# EAGLE design TINRS - Highly Opinionated (EAGLE 7.7.0)

## Sheet 1 of 6
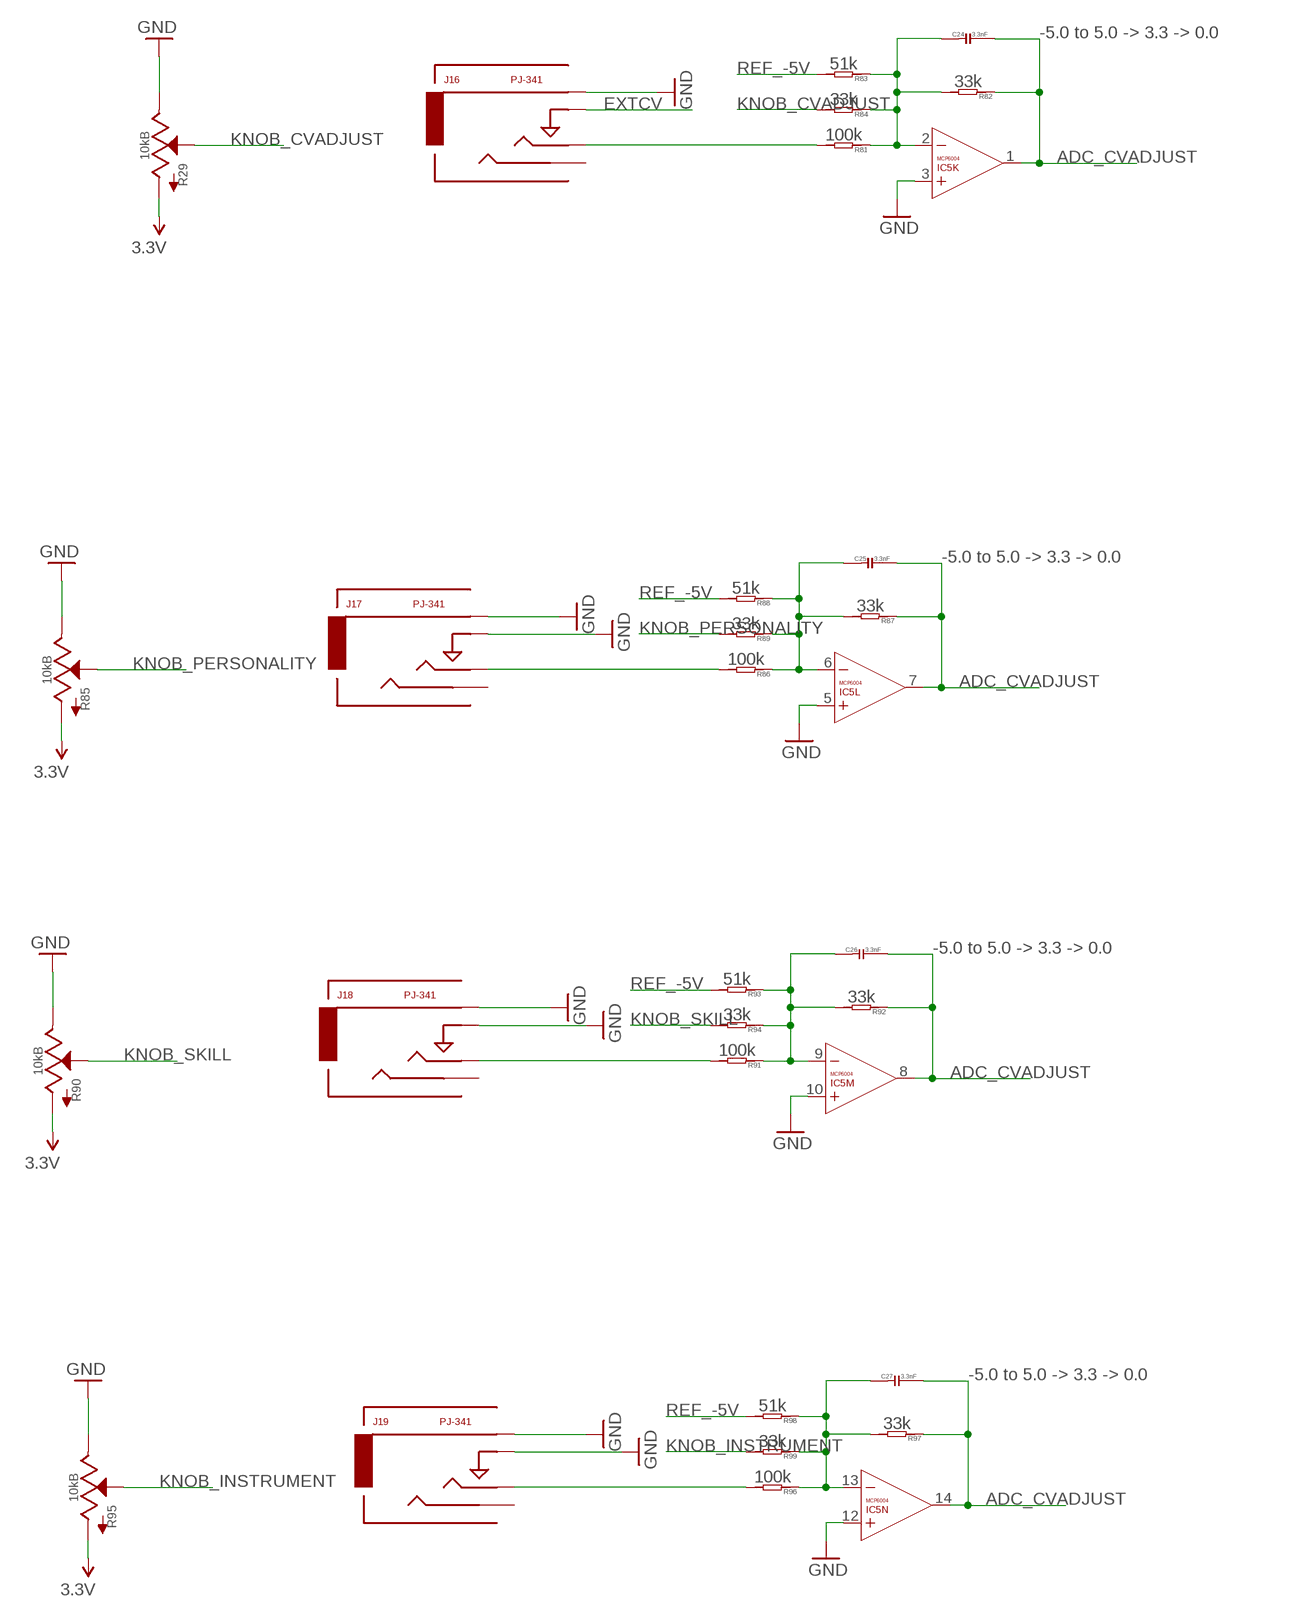
[diagram p0: schematic, sheet 1, part 1 of 2]
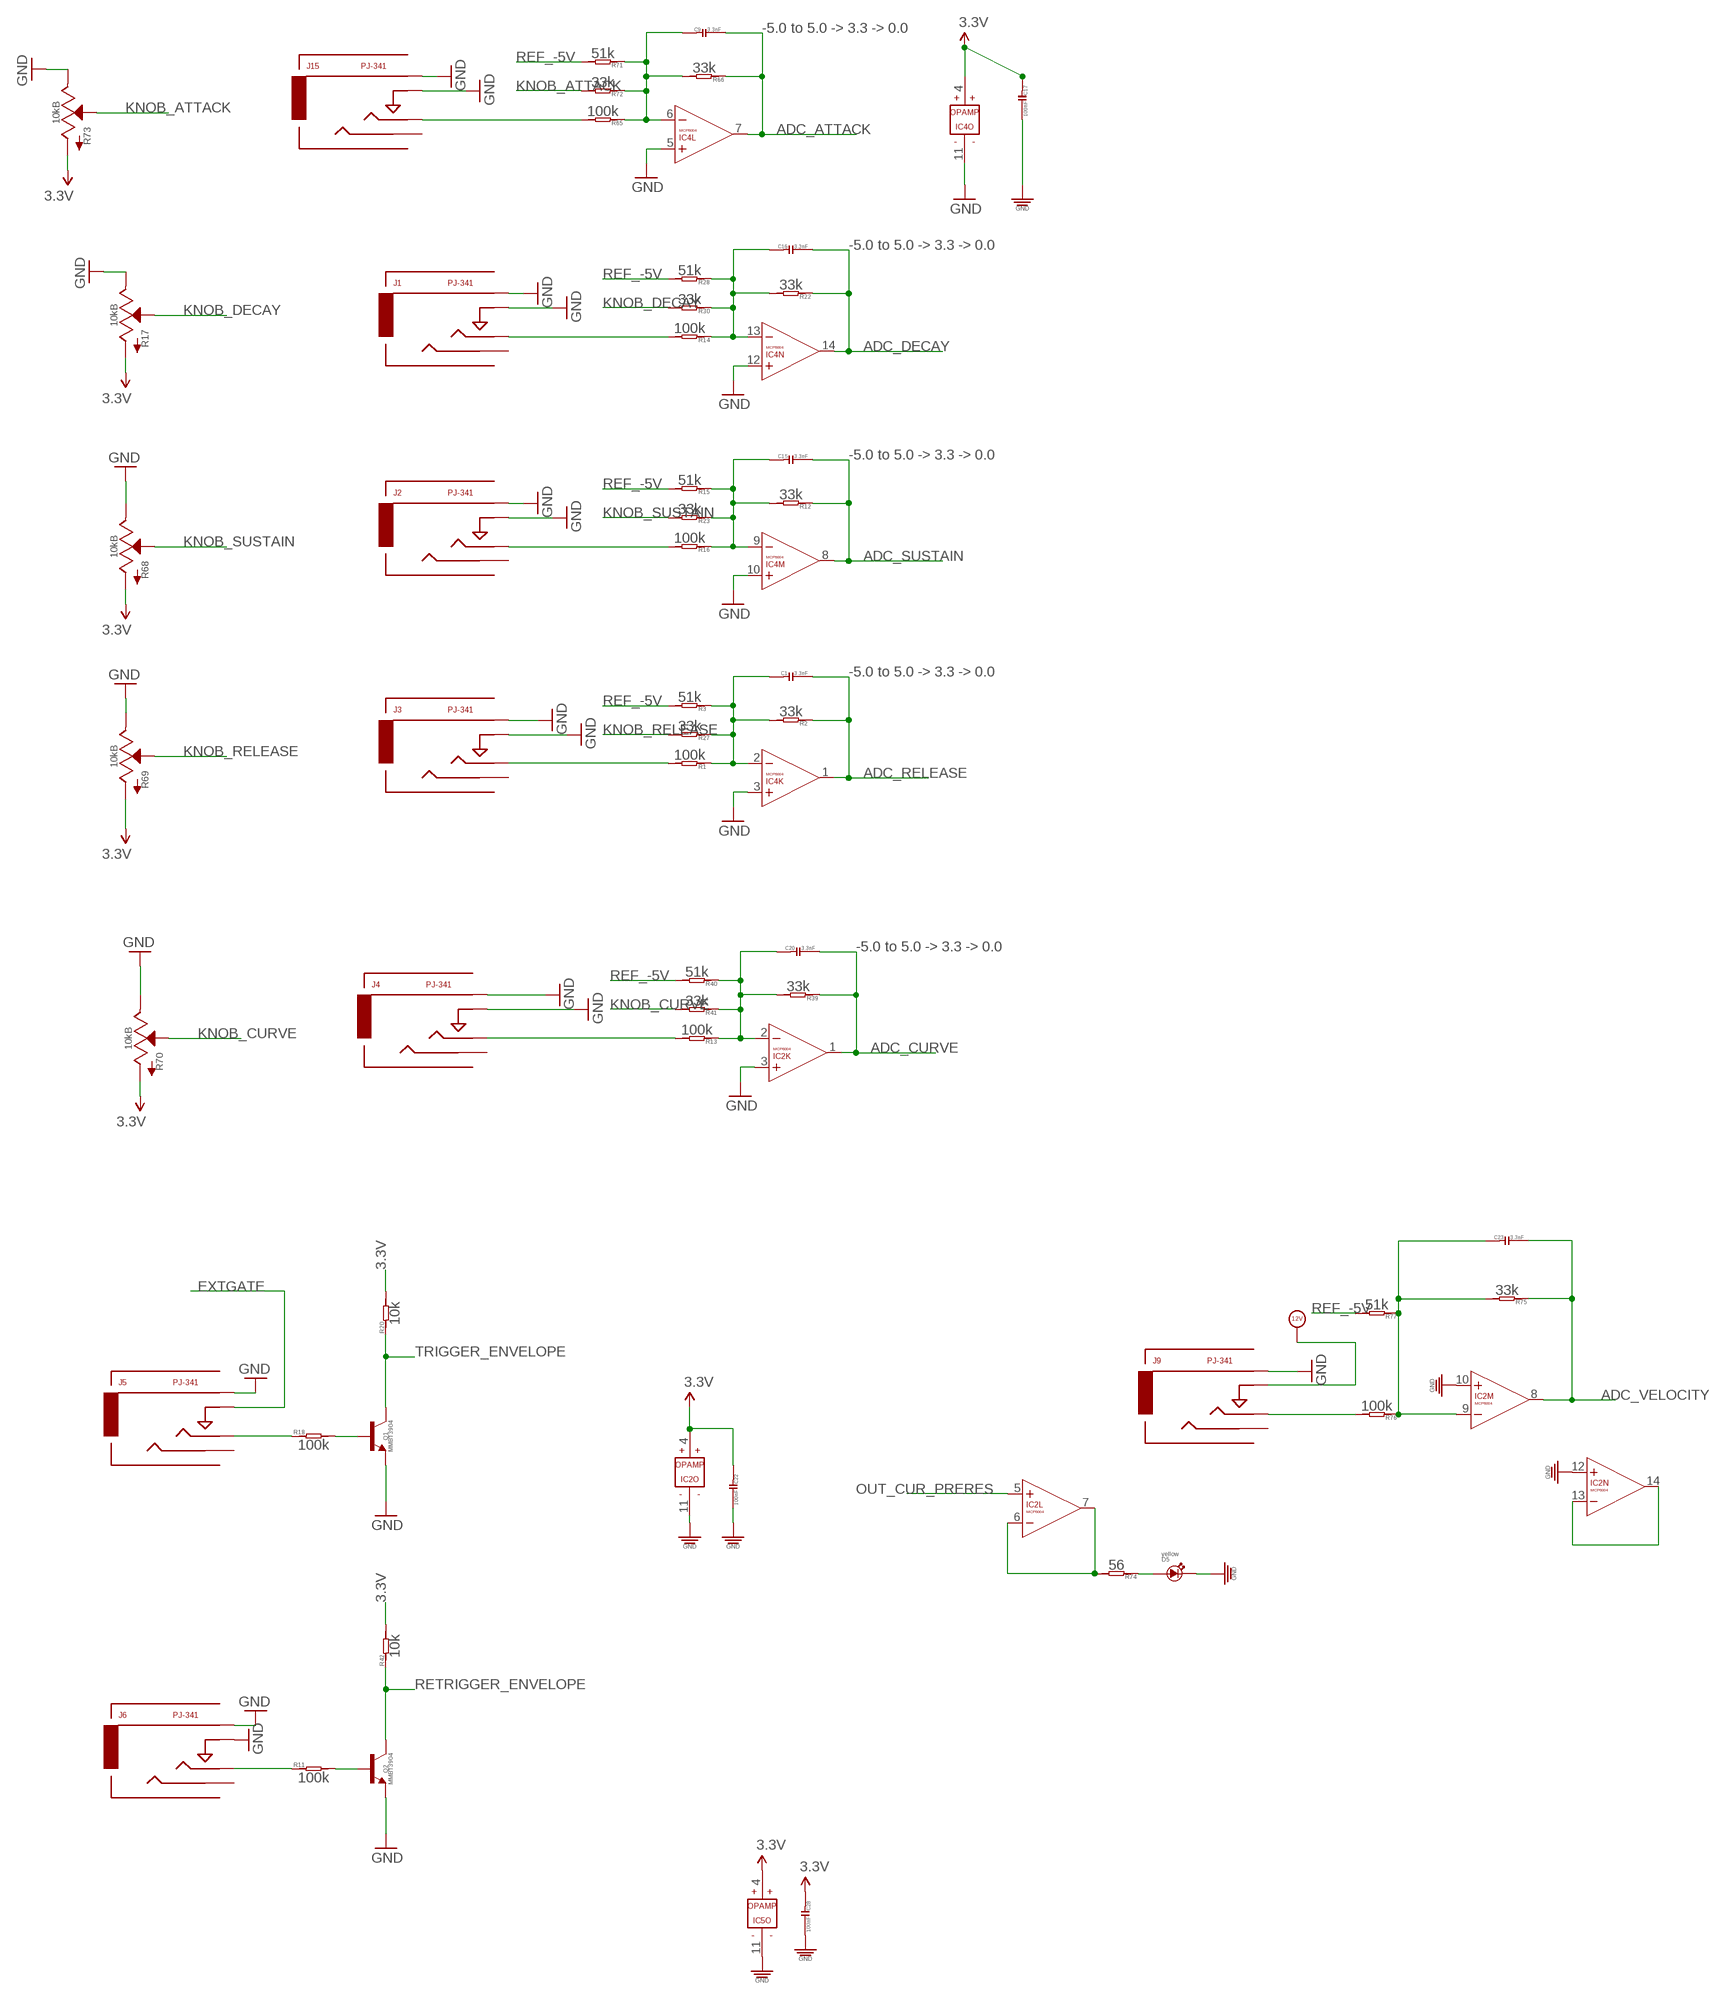
[diagram p1: schematic, sheet 1, part 2 of 2]

### Parts
C1  3.3nF  C-0603  [C0603]
C9  3.3nF  C-0603  [C0603]
C15  3.3nF  C-0603  [C0603]
C16  3.3nF  C-0603  [C0603]
C17  100nF  C-0603  [C0603]
C20  3.3nF  C-0603  [C0603]
C22  100nF  C-0603  [C0603]
C23  3.3nF  C-0603  [C0603]
C24  3.3nF  C-0603  [C0603]
C25  3.3nF  C-0603  [C0603]
C26  3.3nF  C-0603  [C0603]
C27  3.3nF  C-0603  [C0603]
C28  100nF  C-0603  [C0603]
D5  yellow  LED3MM  [3MMLED]
IC2  MCP6004  [SO14]
IC4  MCP6004  [SO14]
IC5  MCP6004  [SO14]
J1  PJ-341  AUDIO-JACKINPUT  [3.5MM-JACK-SWITCH-13MM-INPUT]
J2  PJ-341  AUDIO-JACKINPUT  [3.5MM-JACK-SWITCH-13MM-INPUT]
J3  PJ-341  AUDIO-JACKINPUT  [3.5MM-JACK-SWITCH-13MM-INPUT]
J4  PJ-341  AUDIO-JACKINPUT  [3.5MM-JACK-SWITCH-13MM-INPUT]
J5  PJ-341  AUDIO-JACKINPUT  [3.5MM-JACK-SWITCH-13MM-INPUT]
J6  PJ-341  AUDIO-JACKINPUT  [3.5MM-JACK-SWITCH-13MM-INPUT]
J9  PJ-341  AUDIO-JACKINPUT  [3.5MM-JACK-SWITCH-13MM-INPUT]
J15  PJ-341  AUDIO-JACKINPUT  [3.5MM-JACK-SWITCH-13MM-INPUT]
J16  PJ-341  AUDIO-JACKINPUT  [3.5MM-JACK-SWITCH-13MM-INPUT]
J17  PJ-341  AUDIO-JACKINPUT  [3.5MM-JACK-SWITCH-13MM-INPUT]
J18  PJ-341  AUDIO-JACKINPUT  [3.5MM-JACK-SWITCH-13MM-INPUT]
J19  PJ-341  AUDIO-JACKINPUT  [3.5MM-JACK-SWITCH-13MM-INPUT]
Q1  MMBT3904  MMBT3904LT1-NPN-SOT23-BEC  [SOT23-BEC]
Q2  MMBT3904  MMBT3904LT1-NPN-SOT23-BEC  [SOT23-BEC]
R1  100k  R-0603  [R0603]
R2  33k  R-0603  [R0603]
R3  51k  R-0603  [R0603]
R11  100k  R-0603  [R0603]
R12  33k  R-0603  [R0603]
R13  100k  R-0603  [R0603]
R14  100k  R-0603  [R0603]
R15  51k  R-0603  [R0603]
R16  100k  R-0603  [R0603]
R17  10kB  POTSQUAREHOLE_SMALLKNOB  [ALPS_POT_SQUAREHOLES]
R18  100k  R-0603  [R0603]
R20  10k  R-0603  [R0603]
R22  33k  R-0603  [R0603]
R23  33k  R-0603  [R0603]
R27  33k  R-0603  [R0603]
R28  51k  R-0603  [R0603]
R29  10kB  POTSQUAREHOLE_SMALLKNOB  [ALPS_POT_SQUAREHOLES]
R30  33k  R-0603  [R0603]
R39  33k  R-0603  [R0603]
R40  51k  R-0603  [R0603]
R41  33k  R-0603  [R0603]
R42  10k  R-0603  [R0603]
R65  100k  R-0603  [R0603]
R66  33k  R-0603  [R0603]
R68  10kB  POTSQUAREHOLE_SMALLKNOB  [ALPS_POT_SQUAREHOLES]
R69  10kB  POTSQUAREHOLE_SMALLKNOB  [ALPS_POT_SQUAREHOLES]
R70  10kB  POTSQUAREHOLE_SMALLKNOB  [ALPS_POT_SQUAREHOLES]
R71  51k  R-0603  [R0603]
R72  33k  R-0603  [R0603]
R73  10kB  POTSQUAREHOLE_SMALLKNOB  [ALPS_POT_SQUAREHOLES]
R74  56  R-0603  [R0603]
R75  33k  R-0603  [R0603]
R76  100k  R-0603  [R0603]
R77  51k  R-0603  [R0603]
R81  100k  R-0603  [R0603]
R82  33k  R-0603  [R0603]
R83  51k  R-0603  [R0603]
R84  33k  R-0603  [R0603]
R85  10kB  POTSQUAREHOLE_SMALLKNOB  [ALPS_POT_SQUAREHOLES]
R86  100k  R-0603  [R0603]
R87  33k  R-0603  [R0603]
R88  51k  R-0603  [R0603]
R89  33k  R-0603  [R0603]
R90  10kB  POTSQUAREHOLE_SMALLKNOB  [ALPS_POT_SQUAREHOLES]
R91  100k  R-0603  [R0603]
R92  33k  R-0603  [R0603]
R93  51k  R-0603  [R0603]
R94  33k  R-0603  [R0603]
R95  10kB  POTSQUAREHOLE_SMALLKNOB  [ALPS_POT_SQUAREHOLES]
R96  100k  R-0603  [R0603]
R97  33k  R-0603  [R0603]
R98  51k  R-0603  [R0603]
R99  33k  R-0603  [R0603]

### Nets
3.3V [mediumpower]: C17.1 C22.1 C28.1 IC2.4(O:V+) IC4.4(O:V+) IC5.4(O:V+) R17.P$3(A) R20.2 R29.P$3(A) R42.2 R68.P$3(A) R69.P$3(A) R70.P$3(A) R73.P$3(A) R85.P$3(A) R90.P$3(A) R95.P$3(A) ; also sheet 2,3,4,5,6
12V [heavypower]: J9.SWITCH@3(SWITCH) ; also sheet 3,4,5
ADC_ATTACK: C9.2 IC4.7(L:OUT) R66.1 ; also sheet 6
ADC_CURVE: C20.2 IC2.1(K:OUT) R39.1 ; also sheet 6
ADC_CVADJUST: C24.2 C25.2 C26.2 C27.2 IC5.1(K:OUT) IC5.7(L:OUT) IC5.8(M:OUT) IC5.14(N:OUT) R82.1 R87.1 R92.1 R97.1
ADC_DECAY: C16.2 IC4.14(N:OUT) R22.1 ; also sheet 6
ADC_RELEASE: C1.2 IC4.1(K:OUT) R2.1 ; also sheet 6
ADC_SUSTAIN: C15.2 IC4.8(M:OUT) R12.1 ; also sheet 6
ADC_VELOCITY: C23.2 IC2.8(M:OUT) R75.1 ; also sheet 6
EXTCV: J16.SWITCH@3(SWITCH) ; also sheet 3
EXTGATE: J5.SWITCH@3(SWITCH) ; also sheet 3
GND [groundplane]: C17.2 C22.2 C28.2 D5.- IC2.3(K:+IN) IC2.10(M:+IN) IC2.11(O:V-) IC2.12(N:+IN) IC4.3(K:+IN) IC4.5(L:+IN) IC4.10(M:+IN) IC4.11(O:V-) IC4.12(N:+IN) IC5.3(K:+IN) IC5.5(L:+IN) IC5.10(M:+IN) IC5.11(O:V-) IC5.12(N:+IN) J1.RING@3(RING) J1.SWITCH@3(SWITCH) J2.RING@3(RING) J2.SWITCH@3(SWITCH) J3.RING@3(RING) J3.SWITCH@3(SWITCH) J4.RING@3(RING) J4.SWITCH@3(SWITCH) J5.RING@3(RING) J6.RING@3(RING) J6.SWITCH@3(SWITCH) J9.RING@3(RING) J15.RING@3(RING) J15.SWITCH@3(SWITCH) J16.RING@3(RING) J17.RING@3(RING) J17.SWITCH@3(SWITCH) J18.RING@3(RING) J18.SWITCH@3(SWITCH) J19.RING@3(RING) J19.SWITCH@3(SWITCH) Q1.E Q2.E R17.P$1(E) R29.P$1(E) R68.P$1(E) R69.P$1(E) R70.P$1(E) R73.P$1(E) R85.P$1(E) R90.P$1(E) R95.P$1(E) ; also sheet 2,3,4,5,6
KNOB_ATTACK: R72.2 R73.P$2(S)
KNOB_CURVE: R41.2 R70.P$2(S)
KNOB_CVADJUST: R29.P$2(S) R84.2
KNOB_DECAY: R17.P$2(S) R30.2
KNOB_INSTRUMENT: R95.P$2(S) R99.2
KNOB_PERSONALITY: R85.P$2(S) R89.2
KNOB_RELEASE: R27.2 R69.P$2(S)
KNOB_SKILL: R90.P$2(S) R94.2
KNOB_SUSTAIN: R23.2 R68.P$2(S)
N$3: J2.TIP@3(TIP) R16.2
N$4: C15.1 IC4.9(M:-IN) R12.2 R15.1 R16.1 R23.1
N$6: J3.TIP@3(TIP) R1.2
N$8: C1.1 IC4.2(K:-IN) R1.1 R2.2 R3.1 R27.1
N$9: J16.TIP@3(TIP) R81.2
N$10: C24.1 IC5.2(K:-IN) R81.1 R82.2 R83.1 R84.1
N$11: J15.TIP@3(TIP) R65.2
N$12: J4.TIP@3(TIP) R13.2
N$15: Q1.B R18.2
N$16: J5.TIP@3(TIP) R18.1
N$19 [groundplane]: IC2.6(L:-IN) IC2.7(L:OUT) R74.2
N$22: C9.1 IC4.6(L:-IN) R65.1 R66.2 R71.1 R72.1
N$26 [groundplane]: IC2.13(N:-IN) IC2.14(N:OUT)
N$33: J1.TIP@3(TIP) R14.2
N$34: C16.1 IC4.13(N:-IN) R14.1 R22.2 R28.1 R30.1
N$43: Q2.B R11.2
N$46: C20.1 IC2.2(K:-IN) R13.1 R39.2 R40.1 R41.1
N$47: J6.TIP@3(TIP) R11.1
N$56: C23.1 IC2.9(M:-IN) R75.2 R76.1 R77.1
N$59: D5.+ R74.1
N$60: J17.TIP@3(TIP) R86.2
N$61: J9.TIP@3(TIP) R76.2
N$62: C25.1 IC5.6(L:-IN) R86.1 R87.2 R88.1 R89.1
N$63: J18.TIP@3(TIP) R91.2
N$65: C26.1 IC5.9(M:-IN) R91.1 R92.2 R93.1 R94.1
N$66: J19.TIP@3(TIP) R96.2
N$67: C27.1 IC5.13(N:-IN) R96.1 R97.2 R98.1 R99.1
OUT_CUR_PRERES: IC2.5(L:+IN) ; also sheet 4
REF_-5V: R3.2 R15.2 R28.2 R40.2 R71.2 R77.2 R83.2 R88.2 R93.2 R98.2 ; also sheet 3,4
RETRIGGER_ENVELOPE: Q2.C R42.1 ; also sheet 6
TRIGGER_ENVELOPE: Q1.C R20.1 ; also sheet 6
Unconnected: J1.SECOND@3(SECOND) J2.SECOND@3(SECOND) J3.SECOND@3(SECOND) J4.SECOND@3(SECOND) J5.SECOND@3(SECOND) J6.SECOND@3(SECOND) J9.SECOND@3(SECOND) J15.SECOND@3(SECOND) J16.SECOND@3(SECOND) J17.SECOND@3(SECOND) J18.SECOND@3(SECOND) J19.SECOND@3(SECOND)

### Notes on the sheet
- -5.0 to 5.0 -> 3.3 -> 0.0
- -5.0 to 5.0 -> 3.3 -> 0.0
- -5.0 to 5.0 -> 3.3 -> 0.0
- -5.0 to 5.0 -> 3.3 -> 0.0
- -5.0 to 5.0 -> 3.3 -> 0.0
- -5.0 to 5.0 -> 3.3 -> 0.0
- -5.0 to 5.0 -> 3.3 -> 0.0
- -5.0 to 5.0 -> 3.3 -> 0.0
- -5.0 to 5.0 -> 3.3 -> 0.0

## Sheet 2 of 6: LEDS and Buttons
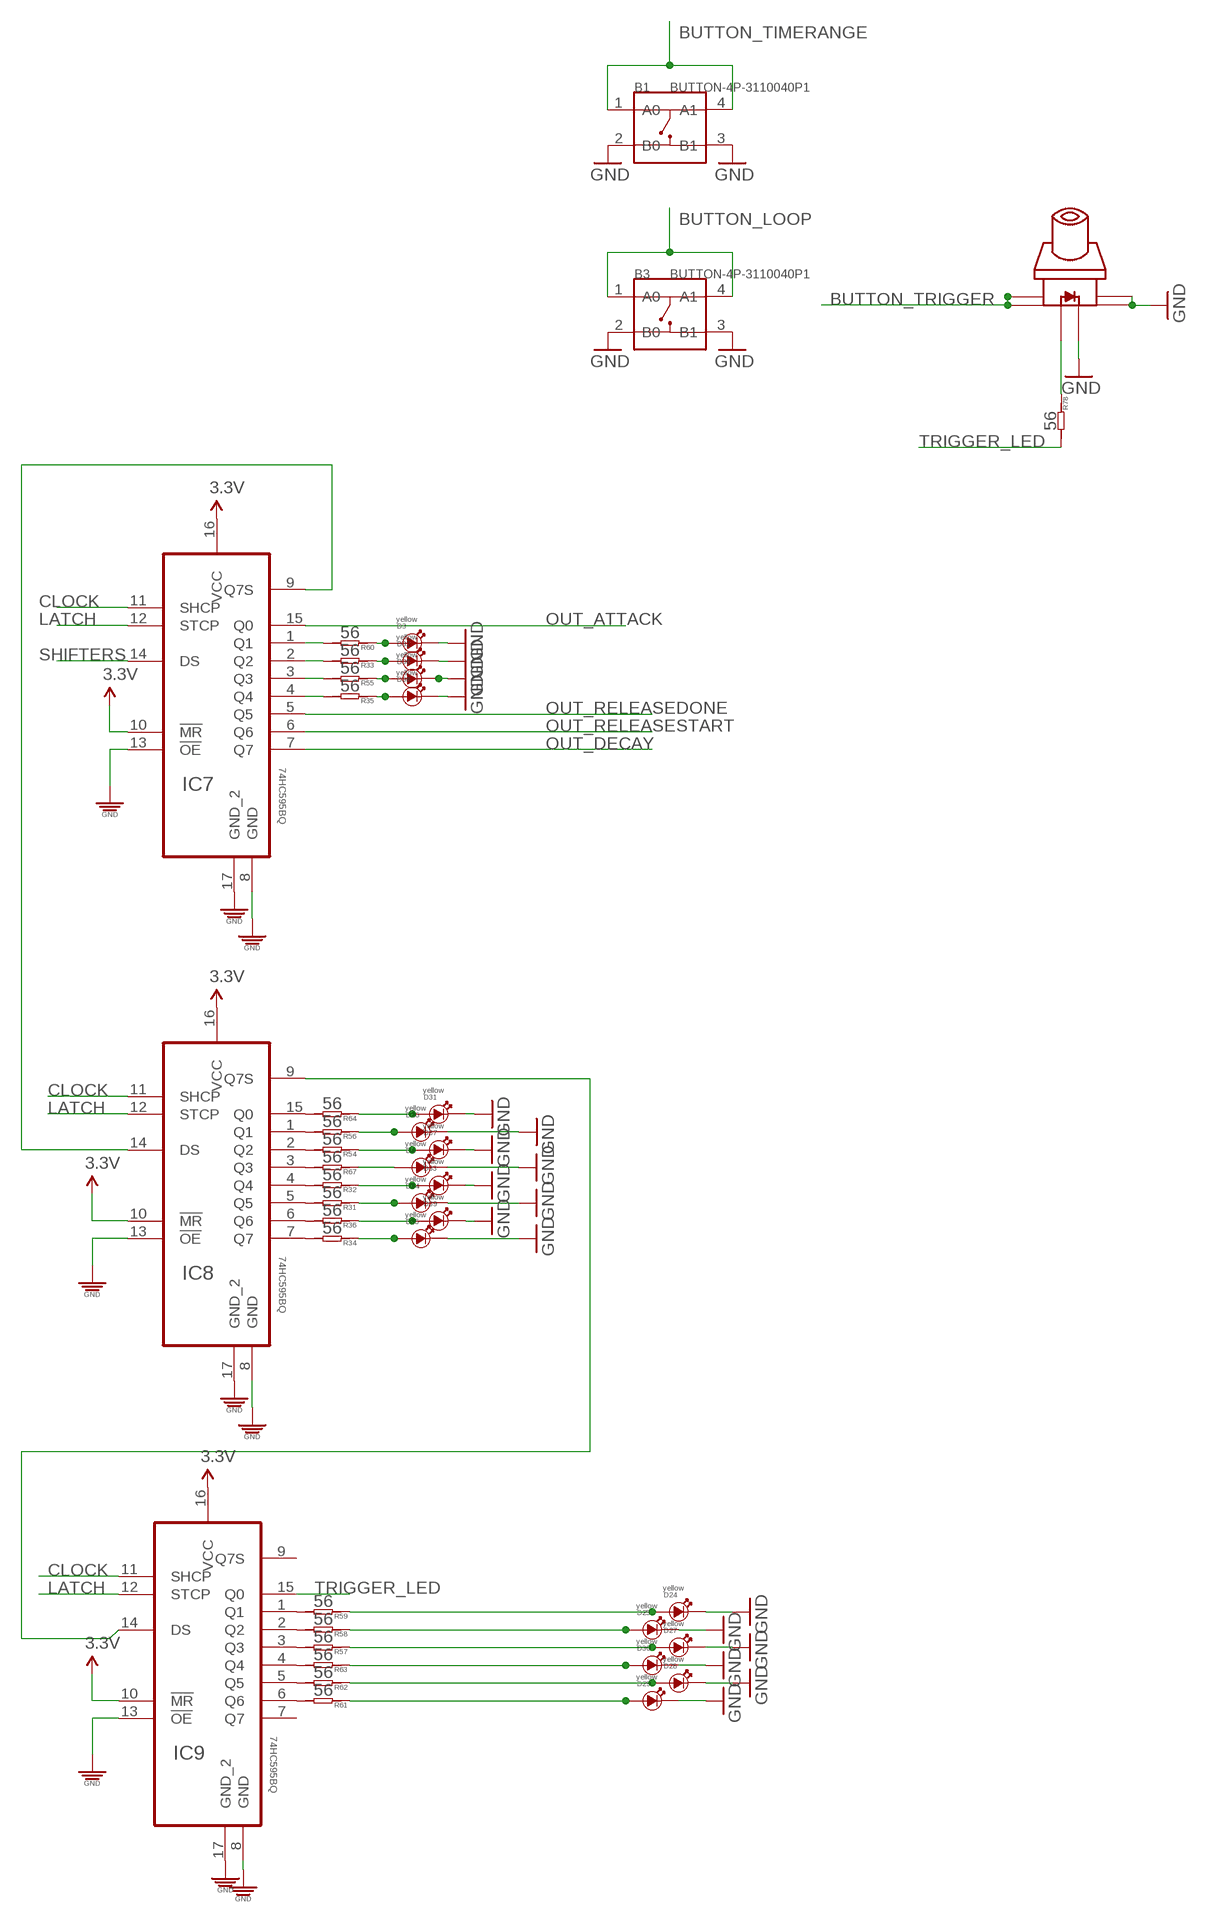
[diagram p2: schematic, sheet 2]

### Parts
B1  BUTTON-4P-3110040P1  [4P-6.0X6.0X5.0H]
B3  BUTTON-4P-3110040P1  [4P-6.0X6.0X5.0H]
D3  yellow  LED3MM  [3MMLED]
D4  yellow  LED3MM  [3MMLED]
D24  yellow  LED3MM  [3MMLED]
D25  yellow  LED3MM  [3MMLED]
D26  yellow  LED3MM  [3MMLED]
D27  yellow  LED3MM  [3MMLED]
D28  yellow  LED3MM  [3MMLED]
D29  yellow  LED3MM  [3MMLED]
D30  yellow  LED3MM  [3MMLED]
D31  yellow  LED3MM  [3MMLED]
D32  yellow  LED3MM  [3MMLED]
D33  yellow  LED3MM  [3MMLED]
D34  yellow  LED3MM  [3MMLED]
D35  yellow  LED3MM  [3MMLED]
D36  yellow  LED3MM  [3MMLED]
D37  yellow  LED3MM  [3MMLED]
D38  yellow  LED3MM  [3MMLED]
D39  yellow  LED3MM  [3MMLED]
IC7  74HC595BQ  [QFN50P250X350X100-17N]
IC8  74HC595BQ  [QFN50P250X350X100-17N]
IC9  74HC595BQ  [QFN50P250X350X100-17N]
R31  56  R-0603  [R0603]
R32  56  R-0603  [R0603]
R33  56  R-0603  [R0603]
R34  56  R-0603  [R0603]
R35  56  R-0603  [R0603]
R36  56  R-0603  [R0603]
R54  56  R-0603  [R0603]
R55  56  R-0603  [R0603]
R56  56  R-0603  [R0603]
R57  56  R-0603  [R0603]
R58  56  R-0603  [R0603]
R59  56  R-0603  [R0603]
R60  56  R-0603  [R0603]
R61  56  R-0603  [R0603]
R62  56  R-0603  [R0603]
R63  56  R-0603  [R0603]
R64  56  R-0603  [R0603]
R67  56  R-0603  [R0603]
R78  56  R-0603  [R0603]
U$2  SWITCH_W_LED_PB6149L-X-102YELLOW  [PB6149L]

### Nets
3.3V [mediumpower]: IC7.10(!MR) IC7.16(VCC) IC8.10(!MR) IC8.16(VCC) IC9.10(!MR) IC9.16(VCC) ; also sheet 1,3,4,5,6
BUTTON_LOOP: B3.1(A0) B3.4(A1) ; also sheet 6
BUTTON_TIMERANGE: B1.1(A0) B1.4(A1) ; also sheet 6
BUTTON_TRIGGER: U$2.1 U$2.2 ; also sheet 6
CLOCK: IC7.11(SHCP) IC8.11(SHCP) IC9.11(SHCP) ; also sheet 6
GND [groundplane]: B1.2(B0) B1.3(B1) B3.2(B0) B3.3(B1) D3.- D4.- D24.- D25.- D26.- D27.- D28.- D29.- D30.- D31.- D32.- D33.- D34.- D35.- D36.- D37.- D38.- D39.- IC7.8(GND) IC7.13(!OE) IC7.17(GND_2) IC8.8(GND) IC8.13(!OE) IC8.17(GND_2) IC9.8(GND) IC9.13(!OE) IC9.17(GND_2) U$2.3 U$2.4 U$2.LEDNEG(NEG) ; also sheet 1,3,4,5,6
LATCH: IC7.12(STCP) IC8.12(STCP) IC9.12(STCP) ; also sheet 6
N$1: R78.1 U$2.LEDPOS(POS)
N$14: IC8.7(Q7) R34.2
N$27: IC8.15(Q0) R64.2
N$28: D28.+ R62.1
N$30: D4.+ R67.1
N$31: IC7.1(Q1) R60.2
N$32: D29.+ R61.1
N$35: IC7.2(Q2) R33.2
N$36: IC7.3(Q3) R55.2
N$37: IC7.4(Q4) R35.2
N$38: IC8.1(Q1) R56.2
N$39: IC8.2(Q2) R54.2
N$40: IC8.3(Q3) R67.2
N$41: IC8.4(Q4) R32.2
N$42: IC8.5(Q5) R31.2
N$48: IC8.6(Q6) R36.2
N$49: IC9.1(Q1) R59.2
N$50: IC9.2(Q2) R58.2
N$51: D3.+ R60.1
N$52: IC9.3(Q3) R57.2
N$53: IC9.4(Q4) R63.2
N$54: IC9.5(Q5) R62.2
N$55: IC9.6(Q6) R61.2
N$73: D27.+ R57.1
N$74: D26.+ R56.1
N$75: D25.+ R58.1
N$76: D24.+ R59.1
N$77: D30.+ R63.1
N$78: D31.+ R64.1
N$79: D32.+ R33.1
N$80: D33.+ R32.1
N$81: D34.+ R31.1
N$82: D35.+ R34.1
N$83: D36.+ R55.1
N$84: D37.+ R54.1
N$85: D38.+ R35.1
N$86: D39.+ R36.1
OUT_ATTACK: IC7.15(Q0) ; also sheet 5
OUT_DECAY: IC7.7(Q7) ; also sheet 5
OUT_RELEASEDONE: IC7.5(Q5) ; also sheet 5
OUT_RELEASESTART: IC7.6(Q6) ; also sheet 5
SHIFTER1TO2: IC7.9(Q7S) IC8.14(DS)
SHIFTER2TO3: IC8.9(Q7S) IC9.14(DS)
SHIFTERS: IC7.14(DS) ; also sheet 6
TRIGGER_LED: IC9.15(Q0) R78.2
Unconnected: IC9.7(Q7) IC9.9(Q7S)

## Sheet 3 of 6: Power
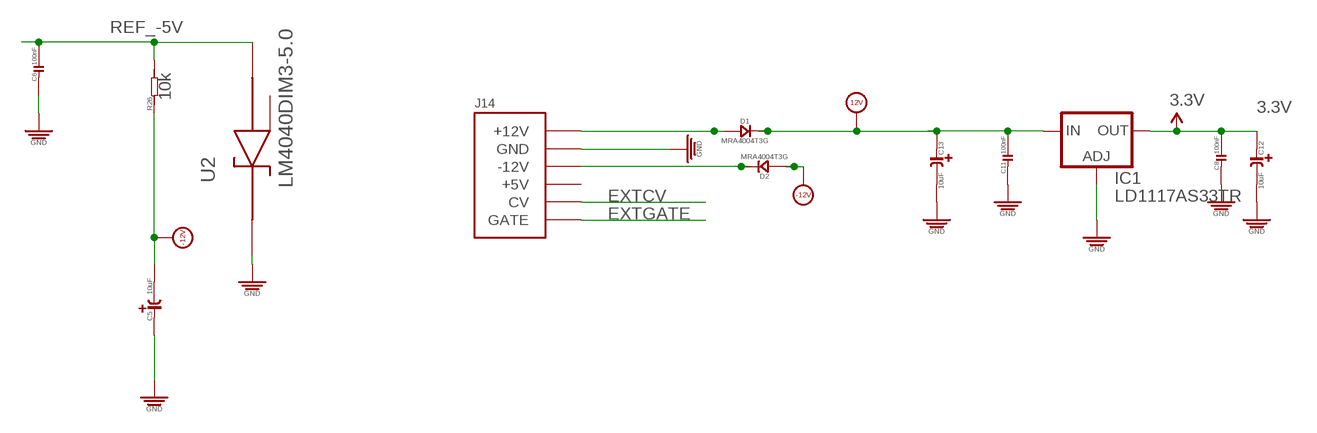
[diagram p3: schematic, sheet 3]

### Parts
C5  10uF  C-POLAR-A  [CASE-A_3216]
C6  100nF  C-0603  [C0603]
C8  100nF  C-0603  [C0603]
C11  100nF  C-0603  [C0603]
C12  10uF  C-POLAR-A  [CASE-A_3216]
C13  10uF  C-POLAR-A  [CASE-A_3216]
D1  MRA4004T3G  D-SMA  [DO-214AC]
D2  MRA4004T3G  D-SMA  [DO-214AC]
IC1  LD1117AS33TR  [SOT223]
J14  POWERSHROUDED  [POWER_16_SHROUDED]
R26  10k  R-0603  [R0603]
U2  LM4040DIM3-5.0  [SOT95P237X112-3N]

### Nets
3.3V [mediumpower]: C8.2 C12.+ IC1.2(OUT) IC1.4(OUT) ; also sheet 1,2,4,5,6
12V [heavypower]: C11.2 C13.+ D1.2(-) IC1.3(IN) ; also sheet 1,4,5
-12V [heavypower]: C5.- D2.1(+) R26.1 ; also sheet 4
EXTCV: J14.13(CV) J14.14(CV) ; also sheet 1
EXTGATE: J14.15(GATE) J14.16(GATE) ; also sheet 1
GND [groundplane]: C5.+ C6.1 C8.1 C11.1 C12.- C13.- IC1.1(ADJ) J14.3(GND) J14.4(GND) J14.5(GND) J14.6(GND) J14.7(GND) J14.8(GND) U2.1(CATHODE) ; also sheet 1,2,4,5,6
N$13 [heavypower]: D1.1(+) J14.9(+12V) J14.10(+12V)
N$64 [heavypower]: D2.2(-) J14.1(-12V) J14.2(-12V)
REF_-5V: C6.2 R26.2 U2.2(ANODE) ; also sheet 1,4
Unconnected: J14.11(+5V) J14.12(+5V) U2.3(NC)

## Sheet 4 of 6: DAC Output
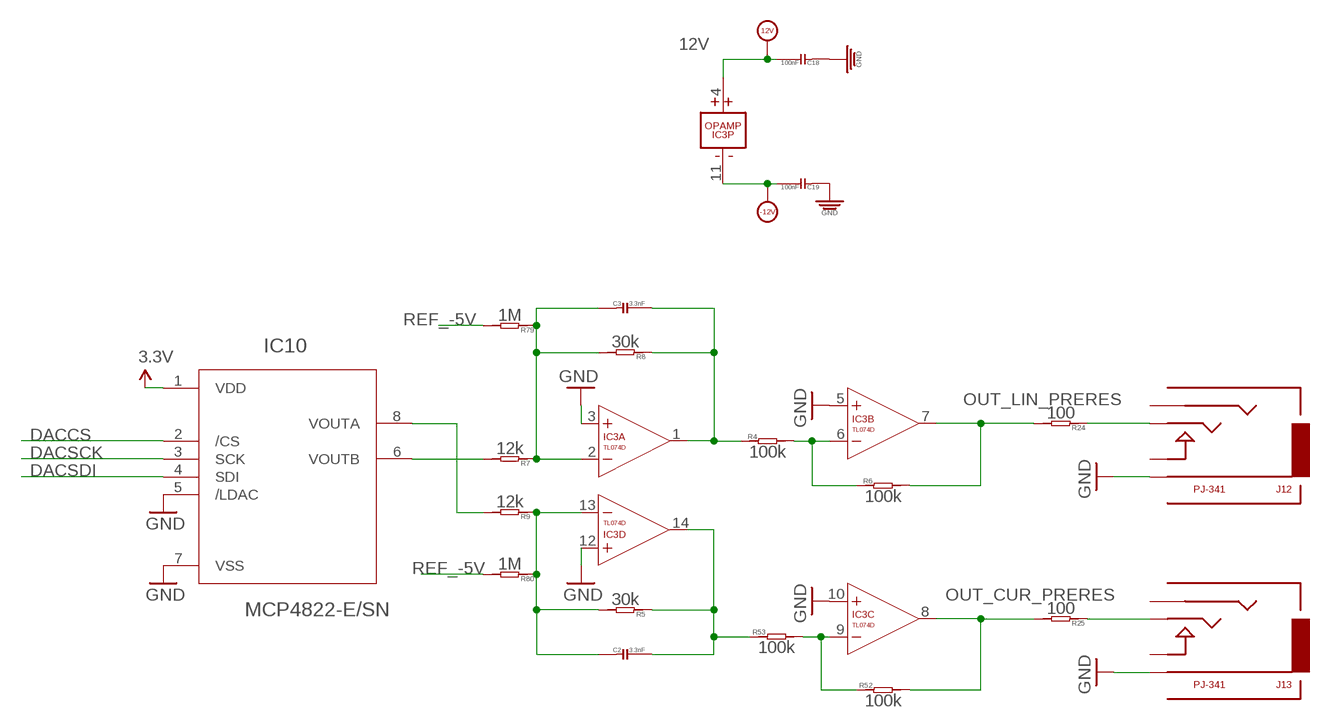
[diagram p4: schematic, sheet 4]

### Parts
C2  3.3nF  C-0603  [C0603]
C3  3.3nF  C-0603  [C0603]
C18  100nF  C-0603  [C0603]
C19  100nF  C-0603  [C0603]
IC3  TL074D  [SO14]
IC10  MCP4822-E/SN  [SOIC8-N_MC]
J12  PJ-341  AUDIO-JACKOUTPUT  [3.5MM-JACK-SWITCH-13MM-OUTPUT]
J13  PJ-341  AUDIO-JACKOUTPUT  [3.5MM-JACK-SWITCH-13MM-OUTPUT]
R4  100k  R-0603  [R0603]
R5  30k  R-0603  [R0603]
R6  100k  R-0603  [R0603]
R7  12k  R-0603  [R0603]
R8  30k  R-0603  [R0603]
R9  12k  R-0603  [R0603]
R24  100  R-0603  [R0603]
R25  100  R-0603  [R0603]
R52  100k  R-0603  [R0603]
R53  100k  R-0603  [R0603]
R79  1M  R-0603  [R0603]
R80  1M  R-0603  [R0603]

### Nets
3.3V [mediumpower]: IC10.1(VDD) ; also sheet 1,2,3,5,6
12V [heavypower]: C18.2 IC3.4(P:V+) ; also sheet 1,3,5
-12V [heavypower]: C19.2 IC3.11(P:V-) ; also sheet 3
DACA_INPUTSUMMER: C2.1 IC3.13(D:-IN) R5.2 R9.1 R80.1
DACB_INPUTSUMMER: C3.1 IC3.2(A:-IN) R7.1 R8.2 R79.1
DACCS: IC10.2(/CS) ; also sheet 6
DACSCK: IC10.3(SCK) ; also sheet 6
DACSDI: IC10.4(SDI) ; also sheet 6
GND [groundplane]: C18.1 C19.1 IC3.3(A:+IN) IC3.5(B:+IN) IC3.10(C:+IN) IC3.12(D:+IN) IC10.5(/LDAC) IC10.7(VSS) J12.RING@3(RING) J13.RING@3(RING) ; also sheet 1,2,3,5,6
N$2: IC3.6(B:-IN) R4.2 R6.1
N$5: IC10.8(VOUTA) R9.2
N$7: IC10.6(VOUTB) R7.2
N$17: IC3.9(C:-IN) R52.1 R53.2
N$18: C3.2 IC3.1(A:OUT) R4.1 R8.1
N$20: J13.TIP@3(TIP) R25.1
N$21: J12.TIP@3(TIP) R24.1
N$24: C2.2 IC3.14(D:OUT) R5.1 R53.1
OUT_CUR_PRERES: IC3.8(C:OUT) R25.2 R52.2 ; also sheet 1
OUT_LIN_PRERES: IC3.7(B:OUT) R6.2 R24.2
REF_-5V: R79.2 R80.2 ; also sheet 1,3
Unconnected: J12.SECOND@3(SECOND) J12.SWITCH@3(SWITCH) J13.SECOND@3(SECOND) J13.SWITCH@3(SWITCH)

## Sheet 5 of 6: State Outputs
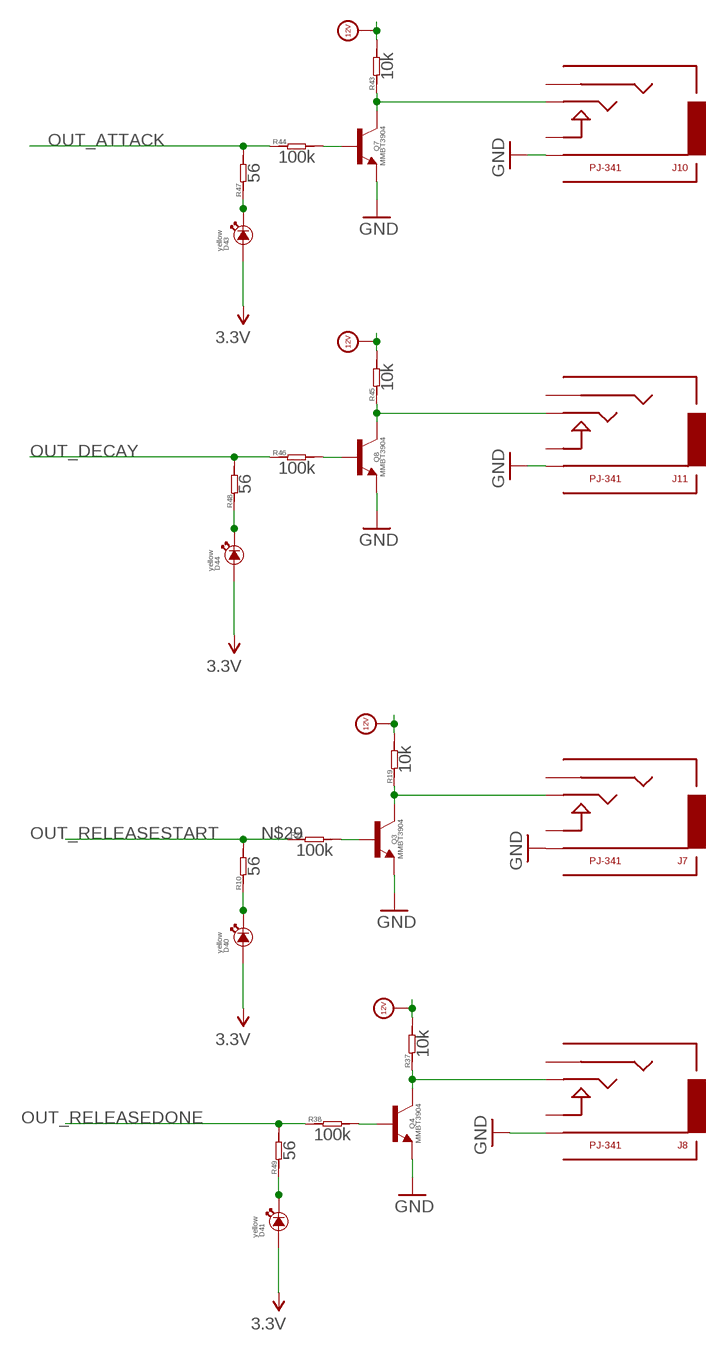
[diagram p5: schematic, sheet 5]

### Parts
D40  yellow  LED3MM  [3MMLED]
D41  yellow  LED3MM  [3MMLED]
D43  yellow  LED3MM  [3MMLED]
D44  yellow  LED3MM  [3MMLED]
J7  PJ-341  AUDIO-JACKOUTPUT  [3.5MM-JACK-SWITCH-13MM-OUTPUT]
J8  PJ-341  AUDIO-JACKOUTPUT  [3.5MM-JACK-SWITCH-13MM-OUTPUT]
J10  PJ-341  AUDIO-JACKOUTPUT  [3.5MM-JACK-SWITCH-13MM-OUTPUT]
J11  PJ-341  AUDIO-JACKOUTPUT  [3.5MM-JACK-SWITCH-13MM-OUTPUT]
Q3  MMBT3904  MMBT3904LT1-NPN-SOT23-BEC  [SOT23-BEC]
Q4  MMBT3904  MMBT3904LT1-NPN-SOT23-BEC  [SOT23-BEC]
Q7  MMBT3904  MMBT3904LT1-NPN-SOT23-BEC  [SOT23-BEC]
Q8  MMBT3904  MMBT3904LT1-NPN-SOT23-BEC  [SOT23-BEC]
R10  56  R-0603  [R0603]
R19  10k  R-0603  [R0603]
R21  100k  R-0603  [R0603]
R37  10k  R-0603  [R0603]
R38  100k  R-0603  [R0603]
R43  10k  R-0603  [R0603]
R44  100k  R-0603  [R0603]
R45  10k  R-0603  [R0603]
R46  100k  R-0603  [R0603]
R47  56  R-0603  [R0603]
R48  56  R-0603  [R0603]
R49  56  R-0603  [R0603]

### Nets
3.3V [mediumpower]: D40.+ D41.+ D43.+ D44.+ ; also sheet 1,2,3,4,6
12V [heavypower]: R19.2 R37.2 R43.2 R45.2 ; also sheet 1,3,4
D21: D43.- R47.1
GND [groundplane]: J7.RING@3(RING) J8.RING@3(RING) J10.RING@3(RING) J11.RING@3(RING) Q3.E Q4.E Q7.E Q8.E ; also sheet 1,2,3,4,6
N$23: D40.- R10.1
N$25: Q3.B R21.2
N$29: J7.TIP@3(TIP) Q3.C R19.1
N$44: D41.- R49.1
N$45: D44.- R48.1
N$57: Q4.B R38.2
N$58: J8.TIP@3(TIP) Q4.C R37.1
N$68: Q7.B R44.2
N$69: J10.TIP@3(TIP) Q7.C R43.1
N$71: Q8.B R46.2
N$72: J11.TIP@3(TIP) Q8.C R45.1
OUT_ATTACK: R44.1 R47.2 ; also sheet 2
OUT_DECAY: R46.1 R48.2 ; also sheet 2
OUT_RELEASEDONE: R38.1 R49.2 ; also sheet 2
OUT_RELEASESTART: R10.2 R21.1 ; also sheet 2
Unconnected: J7.SECOND@3(SECOND) J7.SWITCH@3(SWITCH) J8.SECOND@3(SECOND) J8.SWITCH@3(SWITCH) J10.SECOND@3(SECOND) J10.SWITCH@3(SWITCH) J11.SECOND@3(SECOND) J11.SWITCH@3(SWITCH)

## Sheet 6 of 6: MCU & Eeprom
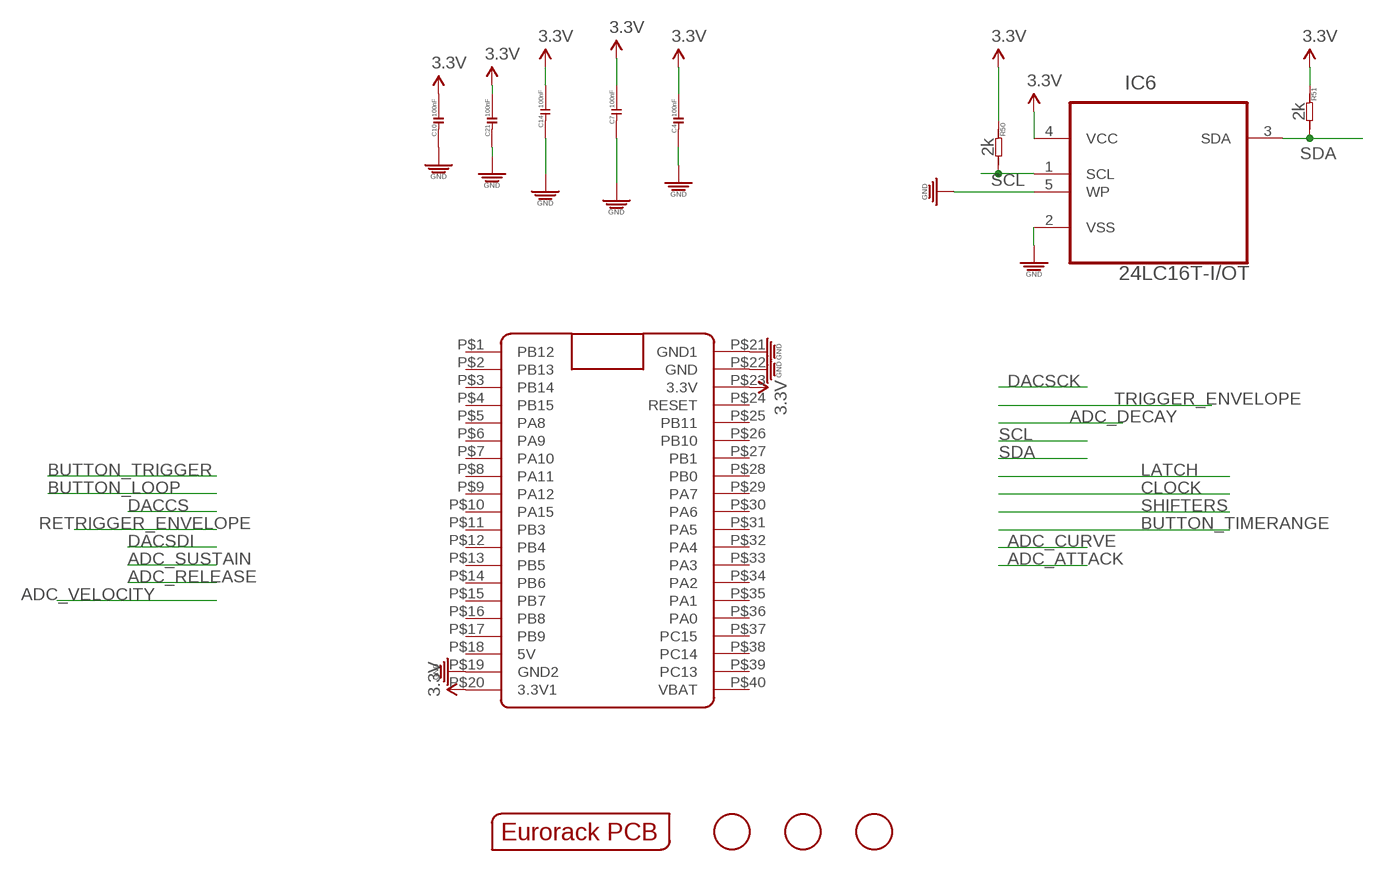
[diagram p6: schematic, sheet 6]

### Parts
C4  100nF  C-0603  [C0603]
C7  100nF  C-0603  [C0603]
C10  100nF  C-0603  [C0603]
C14  100nF  C-0603  [C0603]
C21  100nF  C-0603  [C0603]
FID1  FIDUCIAL  [FIDUCIAL_1MM]
FID2  FIDUCIAL  [FIDUCIAL_1MM]
FID3  FIDUCIAL  [FIDUCIAL_1MM]
IC6  24LC16T-I/OT  24LC00T-I/OT  [SOT95P290X145-5N]
OUTLINE  EURORACK_PCB18HP  [EURORACK18HPPCB]
R50  2k  R-0603  [R0603]
R51  2k  R-0603  [R0603]
U$3  BLUE_PILL  [BLUE_PILL]

### Nets
3.3V [mediumpower]: C4.2 C7.2 C10.2 C14.2 C21.2 IC6.4(VCC) R50.1 R51.1 U$3.P$20(3.3V1) U$3.P$23(3.3V) ; also sheet 1,2,3,4,5
GND [groundplane]: C4.1 C7.1 C10.1 C14.1 C21.1 IC6.2(VSS) IC6.5(WP) U$3.P$19(GND2) U$3.P$21(GND1) U$3.P$22(GND) ; also sheet 1,2,3,4,5
SCL: IC6.1(SCL) R50.2
SDA: IC6.3(SDA) R51.2
Unconnected: U$3.P$1(PB12) U$3.P$2(PB13) U$3.P$3(PB14) U$3.P$4(PB15) U$3.P$5(PA8) U$3.P$6(PA9) U$3.P$7(PA10) U$3.P$8(PA11) U$3.P$9(PA12) U$3.P$10(PA15) U$3.P$11(PB3) U$3.P$12(PB4) U$3.P$13(PB5) U$3.P$14(PB6) U$3.P$15(PB7) U$3.P$16(PB8) U$3.P$17(PB9) U$3.P$18(5V) U$3.P$24(RESET) U$3.P$25(PB11) U$3.P$26(PB10) U$3.P$27(PB1) U$3.P$28(PB0) U$3.P$29(PA7) U$3.P$30(PA6) U$3.P$31(PA5) U$3.P$32(PA4) U$3.P$33(PA3) U$3.P$34(PA2) U$3.P$35(PA1) U$3.P$36(PA0) U$3.P$37(PC15) U$3.P$38(PC14) U$3.P$39(PC13) U$3.P$40(VBAT)

## Library data of the parts
B1 B3 = zephod-components:BUTTON-4P; OC_FARNELL: unknown
C1-C3 C9 C15 C16 C20 C23-C27 = OPL:C*; OC_FARNELL: unknown
C4 C7 C8 C10 C11 C14 C17-C19 C21 C22 C28 = OPL:C*; MF: MULTICOMP; MPN: MC0603F104Z160CT; OC_FARNELL: 1759017
C5 C12 C13 = EurorackModularParts:C-POLAR*; MF: AVX; MPN: TAJB106K020RNJ; OC_FARNELL: 197427
C6 = OPL:C*; MF: AVX; MPN: 06035C104KAT2A; OC_FARNELL: 1301804
D1 D2 = OPL:D*: DIODE; MF: VISHAY; MPN: US1G-E3/5AT; OC_FARNELL: 9551824
D3-D5 D24-D41 D43 D44 = EurorackModularParts:LED*: LED
FID1-FID3 = adafruit:FIDUCIAL: For use by pick and place machines to calibrate the vision/machine, 1mm By microbuilder.eu; OC_FARNELL: unknown
IC1 = ld-components:LD1117A?*: Low drop fixed and adjustable positive voltage regulators 1 A Source: http://www.st.com/stonline/products/literature/ds/7194/ld1117axx.pdf; MF: STMICROELECTRONICS; MPN: LD1117AS33TR; OC_FARNELL: 1467776
IC2 IC4 IC5 = EurorackModularParts:MCP6004; MF: MICROCHIP; MPN: MCP6004-I/SL.; OC_FARNELL: 1605572
IC3 = EurorackModularParts:TL074: OP AMP; MF: TEXAS INSTRUMENTS; MPN: TL074CD; OC_FARNELL: 1103010
IC6 = EurorackModularParts:24LC00T-I/OT: IC, EEPROM 128BIT SERIAL 400KHZ SOT-23-5; MF: MICROCHIP; MPN: 24LC16T-I/OT; OC_FARNELL: 9757864; OC_NEWARK: 62K0574; PACKAGE: SOT-23-5; SUPPLIER: MICROCHIP
IC7-IC9 = FarnellThings:74HC595BQ: 8-bit serial-in, serial or parallel-out shift register,QFN-16; MF: NXP; MPN: 74HC595BQ; OC_FARNELL: 2164850; OC_NEWARK: 43W8000; PACKAGE: QFN-16; SUPPLIER: NXP
IC10 = FarnellThings:MCP4822-E/SN: 12 Bit DAC; DESCRIPTION: 12 Bit DAC; MF: MICROCHIP; MPN: MCP4822-E/SN; OC_FARNELL: 1439414; OC_NEWARK: 31K2975; PACKAGE: SOIC-8; SUPPLIER: Microchip
J1 = EurorackModularParts:AUDIO-JACK: Switching Mono 3.5mm Audio Jack from Erthenvar.; DESC: Decay; OC_FARNELL: unknown
J2 = EurorackModularParts:AUDIO-JACK: Switching Mono 3.5mm Audio Jack from Erthenvar.; DESC: Sustain; OC_FARNELL: unknown
J3 = EurorackModularParts:AUDIO-JACK: Switching Mono 3.5mm Audio Jack from Erthenvar.; DESC: Release; OC_FARNELL: unknown
J4 = EurorackModularParts:AUDIO-JACK: Switching Mono 3.5mm Audio Jack from Erthenvar.; DESC: Curvature; OC_FARNELL: unknown
J5 = EurorackModularParts:AUDIO-JACK: Switching Mono 3.5mm Audio Jack from Erthenvar.; DESC: Gate; OC_FARNELL: unknown
J6 = EurorackModularParts:AUDIO-JACK: Switching Mono 3.5mm Audio Jack from Erthenvar.; DESC: Retrigger; OC_FARNELL: unknown
J7 = EurorackModularParts:AUDIO-JACK: Switching Mono 3.5mm Audio Jack from Erthenvar.; DESC: ReleaseStartTrigger; OC_FARNELL: unknown
J8 = EurorackModularParts:AUDIO-JACK: Switching Mono 3.5mm Audio Jack from Erthenvar.; DESC: ReleaseDoneTrigger; OC_FARNELL: unknown
J9 = EurorackModularParts:AUDIO-JACK: Switching Mono 3.5mm Audio Jack from Erthenvar.; DESC: Velocity; OC_FARNELL: unknown
J10 = EurorackModularParts:AUDIO-JACK: Switching Mono 3.5mm Audio Jack from Erthenvar.; DESC: AttackTrigger; OC_FARNELL: unknown
J11 = EurorackModularParts:AUDIO-JACK: Switching Mono 3.5mm Audio Jack from Erthenvar.; DESC: DecayTrigger; OC_FARNELL: unknown
J12 = EurorackModularParts:AUDIO-JACK: Switching Mono 3.5mm Audio Jack from Erthenvar.; DESC: Linear; OC_FARNELL: unknown
J13 = EurorackModularParts:AUDIO-JACK: Switching Mono 3.5mm Audio Jack from Erthenvar.; DESC: Curved; OC_FARNELL: unknown
J14 = EurorackModularParts:POWER; OC_FARNELL: unknown
J15 = EurorackModularParts:AUDIO-JACK: Switching Mono 3.5mm Audio Jack from Erthenvar.; DESC: Attack; OC_FARNELL: unknown
J16-J19 = EurorackModularParts:AUDIO-JACK: Switching Mono 3.5mm Audio Jack from Erthenvar.; DESC: CV; OC_FARNELL: unknown
OUTLINE = EurorackModularParts:EURORACK_PCB; OC_FARNELL: unknown
Q1-Q4 Q7 Q8 = transistor:*-NPN-: NPN Transistror BF959 corrected 2008.03.06; MF: NXP; MPN: PMBT3904,215; OC_FARNELL: 2336795
R1-R16 R18-R28 R30-R67 R71 R72 R74-R84 R86-R89 R91-R94 R96-R99 = OPL:R*; OC_FARNELL: unknown
R17 R29 R68-R70 R73 R85 R90 R95 = EurorackModularParts:POT; OC_FARNELL: unknown
U2 = FarnellThings:LM4040DIM3-5.0: IC, Precision Micropower Shunt Voltage Reference, 5V,SOT-23-3; MF: TEXAS INSTRUMENTS; MPN: LM4040DIM3-5.0; OC_FARNELL: 9778330; OC_NEWARK: 97K3489; PACKAGE: SOT-23-3; SUPPLIER: TEXAS INSTRUMENTS
U$2 = zephod-components:SWITCH_W_LED_PB6149L-X-102
U$3 = BluePill:BLUE_PILL

## Net classes
0 default: width 0.203 mm, clearance 0.178 mm
1 heavypower: width 0.381 mm
2 mediumpower: width 0.254 mm
3 groundplane: width 0.178 mm, clearance 0.178 mm

## Board
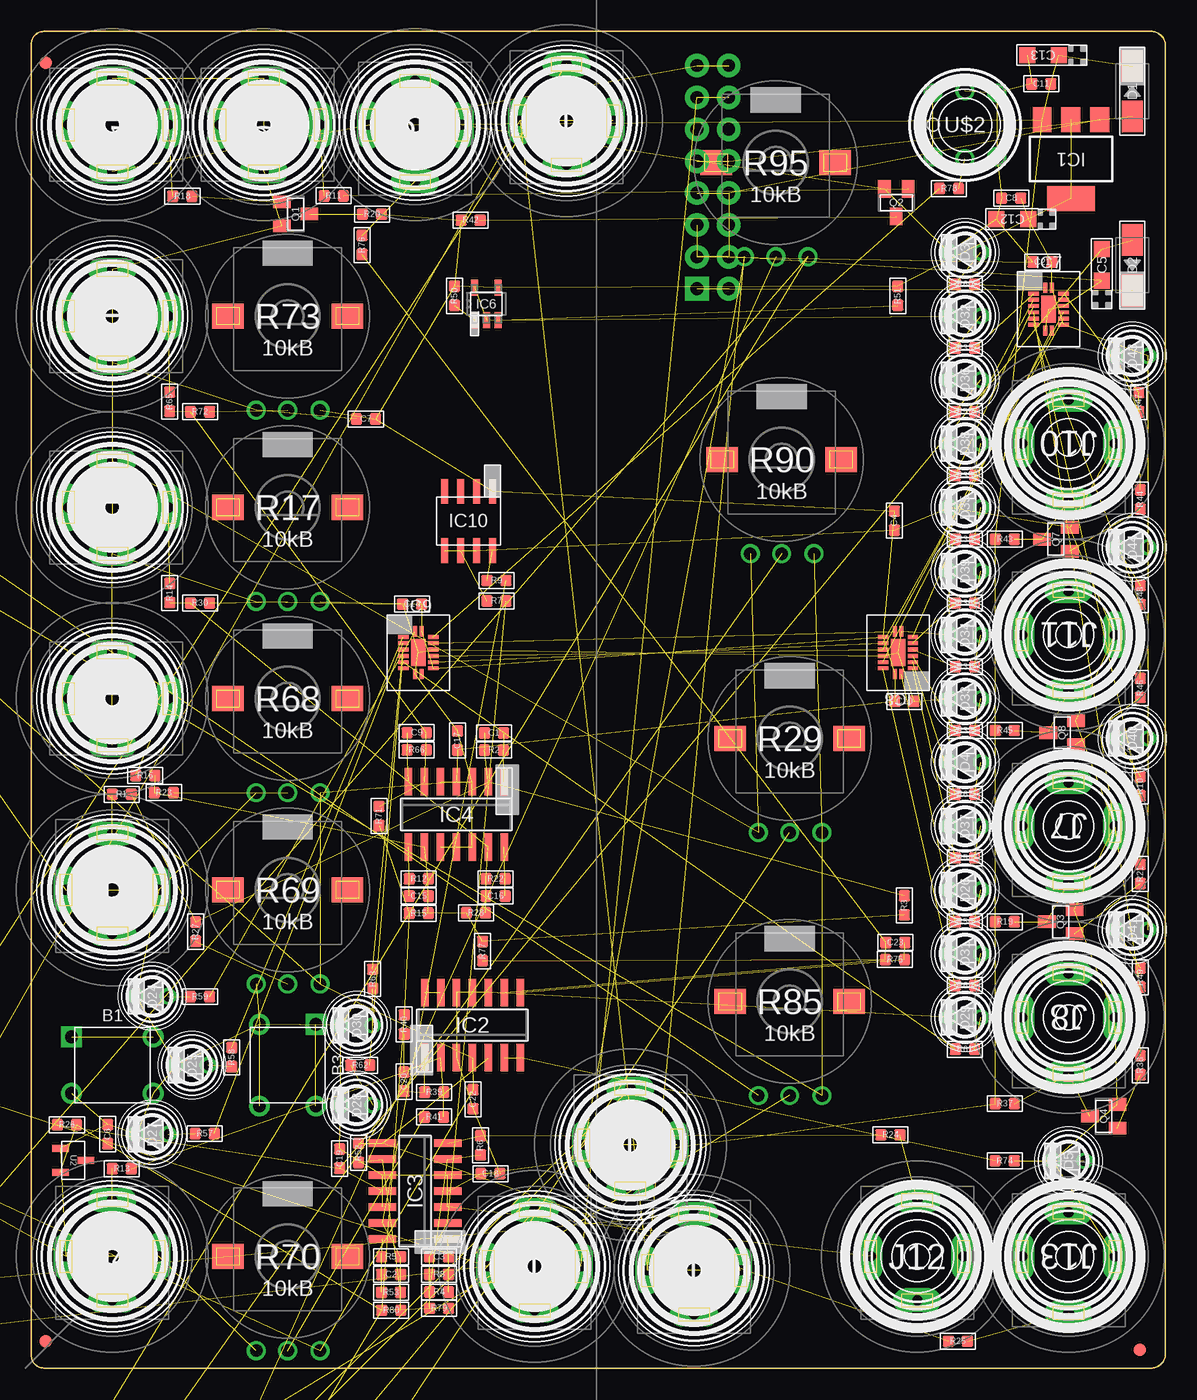
[diagram p7: board, top side]
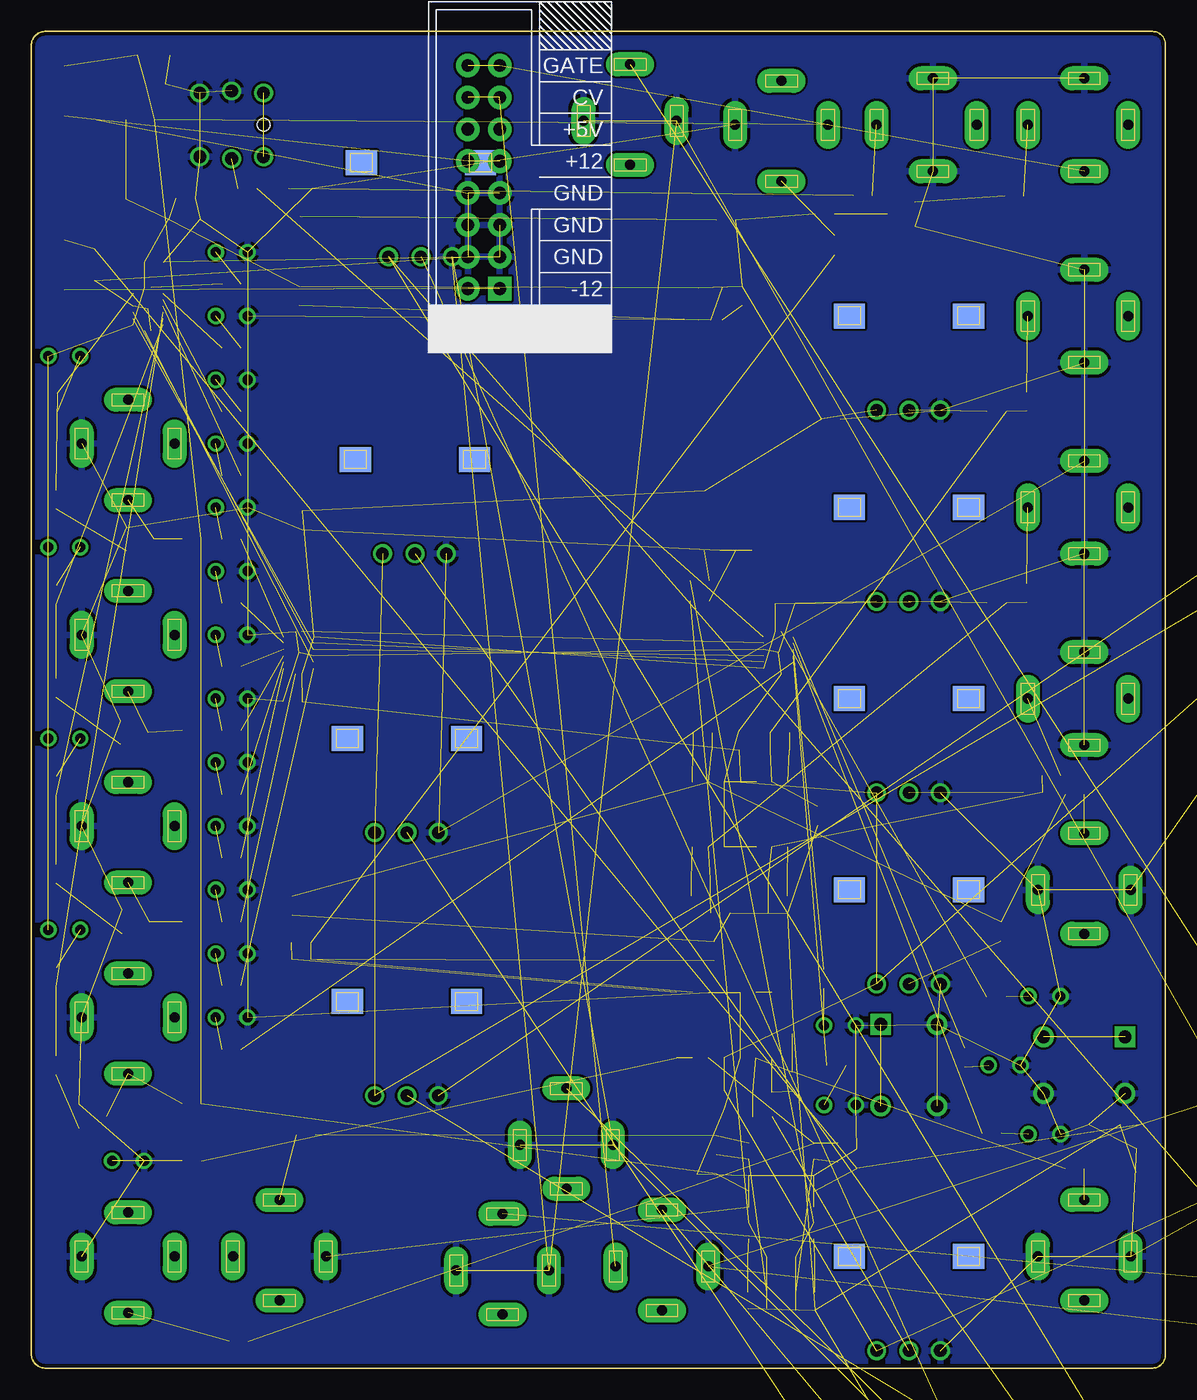
[diagram p8: board, bottom side, seen from below]

Size 90.35 x 106.51 mm. Coordinates in mm from the lower left corner, seen from the top.
Copper layers (1*16): Top 0.035mm / dielectric 1.5mm / Bottom 0.035mm
Design rules "dirt_cheap_dirty_boards.v1 *": minimum track width 5mil, minimum drill 12mil, track to track 5mil, track to pad 5mil, pad to pad 5mil, via to via 5mil, smd to smd 0mil, copper to edge 10mil, drill to drill 10mil, minimum pad ring 10mil, minimum via ring 6mil, stop-mask expansion 2mil, vias tented up to drill 25mil, thermal gap 10mil

### Footprints (pad centres in the part's own frame; a part is rotated, then mirrored left to right if it is on the bottom)
4P-6.0X6.0X5.0H = drill 1.016 pad 1.651 square: 1 -3.25,2.25 | drill 1.016 pad 1.651: 2 -3.25,-2.25; 3 3.25,-2.25; 4 3.25,2.25
C0603 = smd 0.889 x 0.889: 1 -0.762,0; 2 0.762,0
CASE-A_3216 = smd 1.27 x 1.27: + -1.27,0; - 1.27,0
DO-214AC = smd 2.5 x 1.7: 1 -2,0; 2 2,0
3MMLED = drill 0.8: + -1.27,0; - 1.27,0
FIDUCIAL_1MM = smd 1 x 1: 1 0,0
SOT223 = smd 1.5 x 2: 1 -2.3,-3.15; 2 0,-3.15; 3 2.3,-3.15 | smd 3.8 x 2: 4 0,3.15
SO14 = smd 0.6 x 2.2: 1 -3.81,-2.6; 2 -2.54,-2.6; 3 -1.27,-2.6; 4 0,-2.6; 5 1.27,-2.6; 6 2.54,-2.6; 7 3.81,-2.6; 8 3.81,2.6; 9 2.54,2.6; 10 1.27,2.6; 11 0,2.6; 12 -1.27,2.6; 13 -2.54,2.6; 14 -3.81,2.6
SOT95P290X145-5N = smd 1.27 x 0.559: 1 -1.295,0.94; 2 -1.295,0; 3 -1.295,-0.94; 4 1.295,-0.94; 5 1.295,0.94
QFN50P250X350X100-17N = smd 0.305 x 0.813: 1 -0.254,1.702; 8 -0.254,-1.702; 9 0.254,-1.702; 16 0.254,1.702 | smd 0.813 x 0.305: 2 -1.194,1.245; 3 -1.194,0.762; 4 -1.194,0.254; 5 -1.194,-0.254; 6 -1.194,-0.762; 7 -1.194,-1.245; 10 1.194,-1.245; 11 1.194,-0.762; 12 1.194,-0.254; 13 1.194,0.254; 14 1.194,0.762; 15 1.194,1.245 | smd 1.143 x 2.159: 17 0,0
SOIC8-N_MC = smd 1.981 x 0.559: 1 -2.362,1.905; 2 -2.362,0.635; 3 -2.362,-0.635; 4 -2.362,-1.905; 5 2.362,-1.905; 6 2.362,-0.635; 7 2.362,0.635; 8 2.362,1.905
3.5MM-JACK-SWITCH-13MM-INPUT = drill 0.8 pad 1.93 long: RING@3 -3.7,0; SECOND@3 0,-3.5; SWITCH@3 3.7,0; TIP@3 0,4.5
3.5MM-JACK-SWITCH-13MM-OUTPUT = drill 0.8 pad 1.93 long: RING@3 -3.7,0; SECOND@3 0,-3.5; SWITCH@3 3.7,0; TIP@3 0,4.5
POWER_16_SHROUDED = drill 1.016 pad 1.88 square: 1 -8.89,-1.27 | drill 1.016 pad 1.88: 2 -8.89,1.27; 3 -6.35,-1.27; 4 -6.35,1.27; 5 -3.81,-1.27; 6 -3.81,1.27; 7 -1.27,-1.27; 8 -1.27,1.27; 9 1.27,-1.27; 10 1.27,1.27; 11 3.81,-1.27; 12 3.81,1.27; 13 6.35,-1.27; 14 6.35,1.27; 15 8.89,-1.27; 16 8.89,1.27
SOT23-BEC = smd 1 x 1.4: B -0.95,-1.1; C 0,1.1; E 0.95,-1.1
R0603 = smd 0.889 x 0.889: 1 -0.762,0; 2 0.762,0
ALPS_POT_SQUAREHOLES = drill 1: P$1 -2.5,-7.5; P$2 0,-7.5; P$3 2.58,-7.5 | smd 2.5 x 2: P$4 -4.75,0; P$5 4.75,0 | smd 2.5 x 2 bottom: P$6 -4.75,0; P$7 4.75,0
SOT95P237X112-3N = smd 1.321 x 0.559: 1 -1.016,0.94; 2 -1.016,-0.94; 3 1.016,0
PB6149L = drill 1: 1 2.54,2.54; 2 2.54,-2.54; 3 -2.54,2.54; 4 -2.54,-2.54; LEDNEG 0,-2.7; LEDPOS 0,2.7 | hole 1: 2.54,0
BLUE_PILL = drill 0.8 long: P$1 -7.62,15.24; P$2 -7.62,12.7; P$3 -7.62,10.16; P$4 -7.62,7.62; P$5 -7.62,5.08; P$6 -7.62,2.54; P$7 -7.62,0; P$8 -7.62,-2.54; P$9 -7.62,-5.08; P$10 -7.62,-7.62; P$11 -7.62,-10.16; P$12 -7.62,-12.7; P$13 -7.62,-15.24; P$14 -7.62,-17.78; P$15 -7.62,-20.32; P$16 -7.62,-22.86; P$17 -7.62,-25.4; P$18 -7.62,-27.94; P$19 -7.62,-30.48; P$20 -7.62,-33.02; P$21 7.62,15.24; P$22 7.62,12.7; P$23 7.62,10.16; P$24 7.62,7.62; P$25 7.62,5.08; P$26 7.62,2.54; P$27 7.62,0; P$28 7.62,-2.54; P$29 7.62,-5.08; P$30 7.62,-7.62; P$31 7.62,-10.16; P$32 7.62,-12.7; P$33 7.62,-15.24; P$34 7.62,-17.78; P$35 7.62,-20.32; P$36 7.62,-22.86; P$37 7.62,-25.4; P$38 7.62,-27.94; P$39 7.62,-30.48; P$40 7.62,-33.02

### Placement (x,y rotation side)
B1  6.45,24.14 0 top
B3  20.42,24.14 270 top
C1  36.86,50.61 0 top
C2  28.66,7.47 180 top
C3  32.48,8.87 0 top
C4  68.77,67.53 90 top
C5  85.3,87.91 90 top
C6  6.08,18.65 270 top
C7  26.66,75.63 0 top
C8  78.08,93.22 0 top
C9  30.7,50.63 180 top
C10  69.56,53.13 180 top
C11  80.47,102.33 0 top
C12  78.16,91.56 180 top
C13  80.62,104.62 180 top
C14  30.33,60.88 0 top
C15  30.86,37.61 180 top
C16  36.99,37.61 0 top
C17  33.95,50.01 90 top
C18  36.57,15.5 180 top
C19  24.57,16.7 270 top
C20  29.69,22.83 270 top
C21  80.56,88.13 0 top
C22  35.18,21.42 270 top
C23  68.84,33.91 0 top
C24  -27.05,-3.64 0 top  (outside the outline)
C25  -27.05,-11.42 0 top  (outside the outline)
C26  -14.35,-29.36 0 top  (outside the outline)
C27  -16.89,-39.68 0 top  (outside the outline)
C28  -16.73,-42.06 0 top  (outside the outline)
D1  87.73,101.74 90 top
D2  87.73,87.89 270 top
D3  74.39,88.91 180 top
D4  74.39,48.27 180 top
D5  82.65,16.52 180 top
D24  9.62,29.63 180 top
D25  12.8,24.14 180 top
D26  74.39,38.11 180 top
D27  9.62,18.64 180 top
D28  25.92,20.96 180 top
D29  74.39,27.95 180 top
D30  25.92,27.31 180 top
D31  74.39,33.03 180 top
D32  74.39,83.83 180 top
D33  74.39,53.35 180 top
D34  74.39,58.43 180 top
D35  74.39,68.59 180 top
D36  74.39,78.75 180 top
D37  74.39,43.19 180 top
D38  74.39,73.67 180 top
D39  74.39,63.51 180 top
D40  87.73,50.17 180 top
D41  87.73,34.93 180 top
D43  87.73,80.65 180 top
D44  87.73,65.41 180 top
FID1  1.15,104.02 180 top
FID2  88.34,1.47 0 top
FID3  1.13,2.14 0 top
IC1  82.84,96.34 180 top
IC2  35.15,27.33 0 top
IC3  30.58,14.1 90 top
IC4  33.86,44.11 180 top
IC5  -18.31,-1.1 0 top  (outside the outline)
IC6  36.25,84.8 90 top
IC7  81.06,84.38 0 top
IC8  69.06,57.01 180 top
IC9  30.83,57.01 0 top
IC10  34.83,67.51 270 top
J1  6.45,68.59 270 top
J2  6.45,53.35 270 top
J3  6.45,38.11 0 top
J4  6.45,8.9 0 top
J5  6.45,99.07 270 top
J6  18.52,99.07 270 top
J7  82.65,43.19 180 top
J8  82.65,27.95 180 top
J9  30.58,99.07 180 top
J10  82.65,73.67 180 top
J11  82.65,58.43 180 top
J12  70.58,8.9 0 top
J13  82.65,8.9 180 top
J14  54.3,94.9 90 bottom
J15  6.45,83.83 270 top
J16  40.1,8.1 0 top
J17  42.64,99.38 0 top
J18  52.8,7.79 0 top
J19  47.73,17.79 0 top
OUTLINE  -0.5,0.01 0 top
Q1  21.06,91.96 270 top
Q2  68.92,92.86 180 top
Q3  82.02,35.57 90 top
Q4  85.45,20.07 90 top
Q7  81.65,66.05 90 top
Q8  82.14,50.63 90 top
R1  7.2,45.73 180 top
R2  36.86,49.24 180 top
R3  69.57,36.88 270 top
R4  32.48,6.06 180 top
R5  28.66,8.87 0 top
R6  35.78,17.76 90 top
R7  37.07,61.13 180 top
R8  32.48,7.47 180 top
R9  37.07,62.76 180 top
R10  88.36,46.36 270 top
R11  24.09,93.41 0 top
R12  30.86,38.99 0 top
R13  7.21,15.89 180 top
R14  11.03,61.76 90 top
R15  30.86,36.24 180 top
R16  9.07,47.22 180 top
R17  20.42,68.59 0 top
R18  12.04,93.37 0 top
R19  77.57,35.57 180 top
R20  27.14,91.95 0 top
R21  88.36,39.38 270 top
R22  36.99,38.99 180 top
R23  10.56,45.85 0 top
R24  68.46,18.59 180 top
R25  73.83,2.14 180 top
R26  2.83,19.4 0 top
R27  13.09,34.78 270 top
R28  35.42,36.28 180 top
R29  60.42,50.17 0 top
R30  13.44,60.97 0 top
R31  74.39,55.89 180 top
R32  74.39,50.81 180 top
R33  74.39,81.29 0 top
R34  74.39,66.05 180 top
R35  74.39,71.13 180 top
R36  74.39,60.97 180 top
R37  77.57,21.08 180 top
R38  88.36,24.14 270 top
R39  32.1,21.99 0 top
R40  29.7,27.38 90 top
R41  32.08,20.01 180 top
R42  35,91.47 180 top
R43  77.57,66.05 180 top
R44  88.36,69.22 270 top
R45  77.57,50.81 180 top
R46  88.36,54.2 270 top
R47  88.24,76.97 90 top
R48  88.36,61.6 270 top
R49  88.36,31.12 270 top
R50  33.71,85.44 270 top
R51  69.03,85.44 270 top
R52  26.07,17.15 90 top
R53  28.66,6.03 0 top
R54  74.39,40.65 180 top
R55  74.39,76.21 0 top
R56  74.39,35.57 180 top
R57  13.82,18.69 0 top
R58  15.97,24.77 90 top
R59  13.44,29.6 0 top
R60  74.39,86.37 0 top
R61  74.39,25.41 180 top
R62  26.2,24.13 0 top
R63  27.2,31.01 90 top
R64  74.39,30.49 180 top
R65  11.02,77.01 90 top
R66  30.7,49.26 0 top
R67  74.39,45.73 180 top
R68  20.42,53.35 0 top
R69  20.42,38.11 0 top
R70  20.42,8.9 0 top
R71  27.7,44 270 top
R72  13.44,76.21 0 top
R73  20.42,83.83 0 top
R74  77.56,16.51 180 top
R75  68.82,32.55 180 top
R76  26.34,89.49 90 top
R77  35.95,33.23 90 top
R78  73.12,93.99 180 top
R79  32.48,4.77 0 top
R80  28.67,4.61 180 top
R81  -10.06,-46.35 0 top  (outside the outline)
R82  -14.19,-15.87 0 top  (outside the outline)
R83  -3.08,-46.35 0 top  (outside the outline)
R84  0.42,-46.35 0 top  (outside the outline)
R85  60.42,29.22 0 top
R86  -30.38,-8.41 0 top  (outside the outline)
R87  -31.97,1.75 0 top  (outside the outline)
R88  -33.55,-16.03 0 top  (outside the outline)
R89  -7.2,-18.57 0 top  (outside the outline)
R90  59.79,72.4 0 top
R91  -16.41,6.04 0 top  (outside the outline)
R92  -24.35,-26.35 0 top  (outside the outline)
R93  -20.85,-23.81 0 top  (outside the outline)
R94  -7.2,-28.89 0 top  (outside the outline)
R95  59.31,96.05 0 top
R96  -4.98,-29.04 0 top  (outside the outline)
R97  -1.49,-29.04 0 top  (outside the outline)
R98  2,-29.04 0 top  (outside the outline)
R99  5.5,-29.04 0 top  (outside the outline)
U2  3.33,16.56 0 top
U$2  74.39,99.07 180 top
U$3  -33.55,63.98 0 top  (outside the outline)

### Tracks (layer width: path | path; a pad name or v marks a point on that pad's centre or on a via)
3.3V  (41 unrouted)
12V  (10 unrouted)
-12V  (4 unrouted)
ADC_ATTACK  (2 unrouted)
ADC_CURVE  (2 unrouted)
ADC_CVADJUST  (11 unrouted)
ADC_DECAY  (2 unrouted)
ADC_RELEASE  (2 unrouted)
ADC_SUSTAIN  (2 unrouted)
ADC_VELOCITY  (2 unrouted)
BUTTON_LOOP  (1 unrouted)
BUTTON_TIMERANGE  (1 unrouted)
BUTTON_TRIGGER  (1 unrouted)
CLOCK  (2 unrouted)
D21  (1 unrouted)
DACA_INPUTSUMMER  (4 unrouted)
DACB_INPUTSUMMER  (4 unrouted)
EXTCV  (2 unrouted)
EXTGATE  (2 unrouted)
GND  (125 unrouted)
  pour Bottom: -2.7,109.3 -2.7,-2.46 94.35,-2.53 94.35,109.23
KNOB_ATTACK  (1 unrouted)
KNOB_CURVE  (1 unrouted)
KNOB_CVADJUST  (1 unrouted)
KNOB_DECAY  (1 unrouted)
KNOB_INSTRUMENT  (1 unrouted)
KNOB_PERSONALITY  (1 unrouted)
KNOB_RELEASE  (1 unrouted)
KNOB_SKILL  (1 unrouted)
KNOB_SUSTAIN  (1 unrouted)
LATCH  (2 unrouted)
N$1  (1 unrouted)
N$2  (2 unrouted)
N$3  (1 unrouted)
N$4  (5 unrouted)
N$5  (1 unrouted)
N$6  (1 unrouted)
N$7  (1 unrouted)
N$8  (5 unrouted)
N$9  (1 unrouted)
N$10  (5 unrouted)
N$11  (1 unrouted)
N$12  (1 unrouted)
N$13  (2 unrouted)
N$14  (1 unrouted)
N$15  (1 unrouted)
N$16  (1 unrouted)
N$17  (2 unrouted)
N$18  (3 unrouted)
N$19  (2 unrouted)
N$20  (1 unrouted)
N$21  (1 unrouted)
N$22  (5 unrouted)
N$23  (1 unrouted)
N$24  (3 unrouted)
N$25  (1 unrouted)
N$26  (1 unrouted)
N$27  (1 unrouted)
N$28  (1 unrouted)
N$29  (2 unrouted)
N$30  (1 unrouted)
N$31  (1 unrouted)
N$32  (1 unrouted)
N$33  (1 unrouted)
N$34  (5 unrouted)
N$35  (1 unrouted)
N$36  (1 unrouted)
N$37  (1 unrouted)
N$38  (1 unrouted)
N$39  (1 unrouted)
N$40  (1 unrouted)
N$41  (1 unrouted)
N$42  (1 unrouted)
N$43  (1 unrouted)
N$44  (1 unrouted)
N$45  (1 unrouted)
N$46  (5 unrouted)
N$47  (1 unrouted)
N$48  (1 unrouted)
N$49  (1 unrouted)
N$50  (1 unrouted)
N$51  (1 unrouted)
N$52  (1 unrouted)
N$53  (1 unrouted)
N$54  (1 unrouted)
N$55  (1 unrouted)
N$56  (4 unrouted)
N$57  (1 unrouted)
N$58  (2 unrouted)
N$59  (1 unrouted)
N$60  (1 unrouted)
N$61  (1 unrouted)
N$62  (5 unrouted)
N$63  (1 unrouted)
N$64  (2 unrouted)
N$65  (5 unrouted)
N$66  (1 unrouted)
N$67  (5 unrouted)
N$68  (1 unrouted)
N$69  (2 unrouted)
N$71  (1 unrouted)
N$72  (2 unrouted)
N$73  (1 unrouted)
N$74  (1 unrouted)
N$75  (1 unrouted)
N$76  (1 unrouted)
N$77  (1 unrouted)
N$78  (1 unrouted)
N$79  (1 unrouted)
N$80  (1 unrouted)
N$81  (1 unrouted)
N$82  (1 unrouted)
N$83  (1 unrouted)
N$84  (1 unrouted)
N$85  (1 unrouted)
N$86  (1 unrouted)
OUT_ATTACK  (2 unrouted)
OUT_CUR_PRERES  (3 unrouted)
OUT_DECAY  (2 unrouted)
OUT_LIN_PRERES  (2 unrouted)
OUT_RELEASEDONE  (2 unrouted)
OUT_RELEASESTART  (2 unrouted)
REF_-5V  (14 unrouted)
RETRIGGER_ENVELOPE  (1 unrouted)
SCL  (1 unrouted)
SDA  (1 unrouted)
SHIFTER1TO2  (1 unrouted)
SHIFTER2TO3  (1 unrouted)
TRIGGER_ENVELOPE  (1 unrouted)
TRIGGER_LED  (1 unrouted)